# EasyEDA Pro project StimFilterV1.eprj, board PCB1
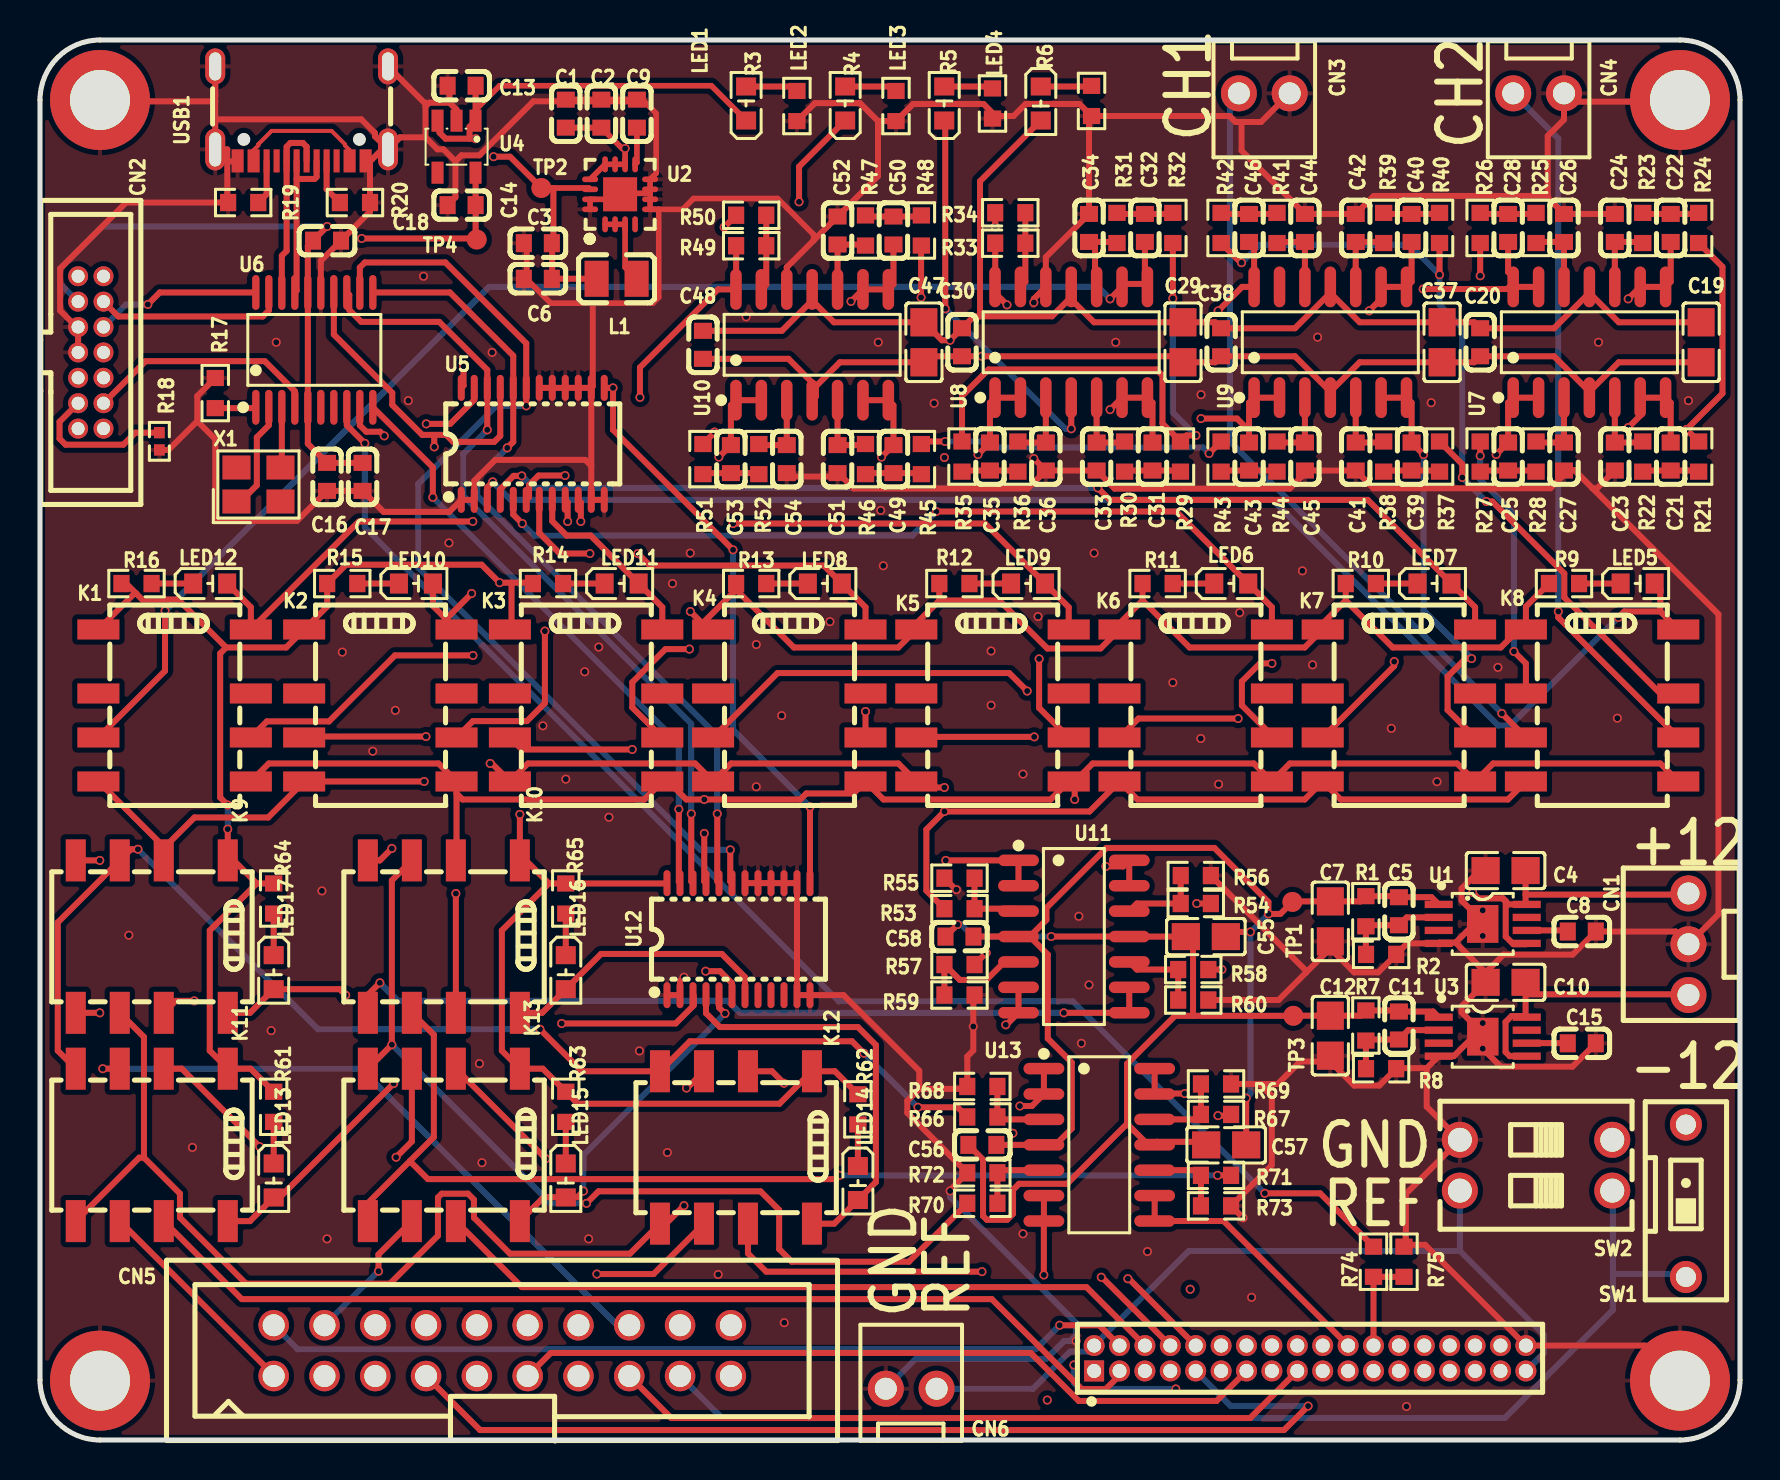
[diagram p2: board, top side]
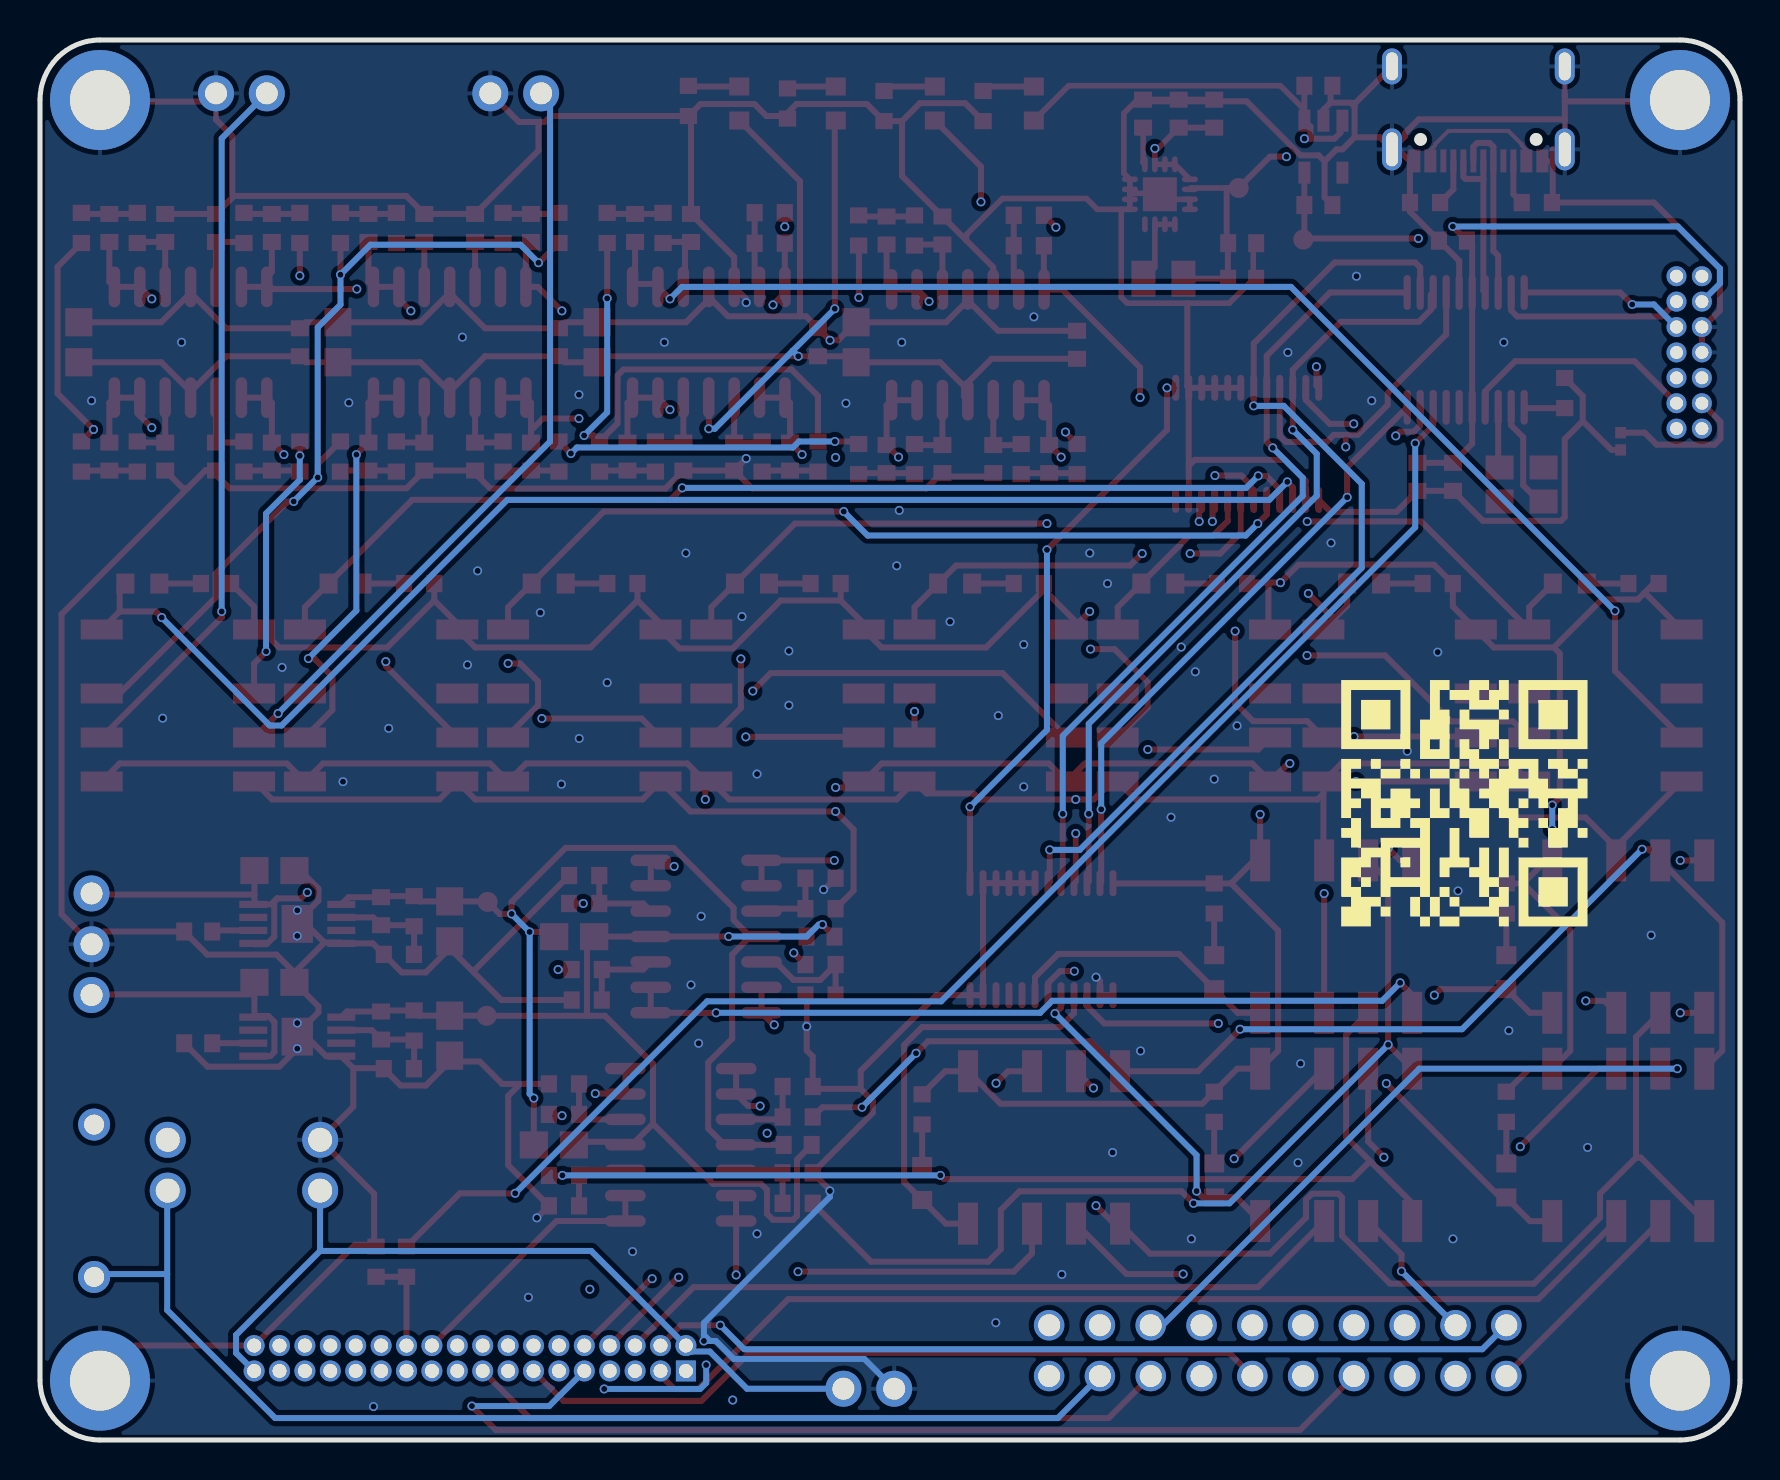
[diagram p3: board, bottom side, seen from below]

Outline 85 x 70 mm; copper layers: Top Layer, Inner1, Inner2, Bottom Layer. Coordinates in mm from the lower left corner of the outline.
Outline path: 0,67 0,3 arc(0.88,0.88) 3,0 82,0 arc(84.12,0.88) 85,3 85,67 arc(84.12,69.12) 82,70 3,70 arc(0.88,69.12) 0,67
Stack: Top Layer 0.035mm Outer layer thickness 1oz / Dielectric1 0.2104mm 7628 RC49% 8.6mil / Inner1 0.0152mm Inner layer thickness / Dielectric2 1.065mm 1.1mm H/HOZ Copper / Inner2 0.0152mm Inner layer thickness / Dielectric3 0.2104mm 7628 RC49% 8.6mil / Bottom Layer 0.035mm Outer layer thickness 1oz

## Design rules (mm)
template: Custom Config
spacing copperThickness1oz (default): track to track 0.102, other pairs 0.152 to 0.3
spacing copperThickness2oz: track to track 0.203, other pairs 0.152 to 0.3
spacing copperThicknessInner0.5oz: track to track 0.089, other pairs 0.152 to 0.3
track width copperThickness1oz (default): min 0.102, default 0.3, max 2.54
track width copperThickness2oz: min 0.203, default 0.254, max 2.54
track width copperThickness0.5oz: min 0.089, default 0.254, max 2.54
differential pair differentialPair (default): width min 0.127, default 0.254, max 2.54; gap min 0.152, default 0.152
via viaSize (default): diameter min 0.3, default 0.45, max 10; hole min 0.2, default 0.3, max 6.3

## Placement (name value [footprint] x y rotation side)
C1  10uF  [C0603]  26.29 66.32 90 top
C2  100nF  [C0603]  28.07 66.32 270 top
C3  22uF  [C0603]  24.89 59.84 0 top
C4  10uF  [C0805]  73.28 28.47 0 top
C5  10nF  [C0603]  67.94 26.44 90 top
C6  100nF  [C0603]  24.89 58.06 0 top
C7  10uF  [C0805]  64.52 25.93 90 top
C8  10nF  [C0603]  77.09 25.42 180 top
C9  3.3nF  [C0603]  29.84 66.32 270 top
C10  10uF  [C0805]  73.28 22.88 0 top
C11  10nF  [C0603]  67.94 20.72 90 top
C12  10uF  [C0805]  64.52 20.22 90 top
C13  10uF  [C0603]  21.08 67.71 180 top
C14  10uF  [C0603]  21.08 61.74 180 top
C15  10nF  [C0603]  77.09 19.83 180 top
C16  10uF  [C0603]  14.35 48.16 270 top
C17  100nF  [C0603]  16.13 48.16 90 top
C18  100nF  [C0603]  14.35 59.97 180 top
C19  10uF  [C0805]  83.06 54.89 270 top
C20  100nF  [C0603]  72.01 54.89 270 top
C21  15uF  [C0603]  81.53 49.17 90 top
C22  1.5uF  [C0603]  81.53 60.6 90 top
C23  10uF  [C0603]  78.74 49.17 90 top
C24  1uF  [C0603]  78.74 60.6 90 top
C25  15uF  [C0603]  73.41 49.17 90 top
C26  100nF  [C0603]  76.2 60.6 270 top
C27  10uF  [C0603]  76.2 49.17 90 top
C28  150nF  [C0603]  73.41 60.6 90 top
C29  10uF  [C0805]  57.15 54.89 270 top
C30  100nF  [C0603]  46.1 54.89 270 top
C31  150nF  [C0603]  55.63 49.17 90 top
C32  15nF  [C0603]  55.25 60.6 90 top
C33  100nF  [C0603]  52.83 49.17 90 top
C34  10nF  [C0603]  52.45 60.6 90 top
C35  15nF  [C0603]  47.5 49.17 90 top
C36  10nF  [C0603]  50.29 49.17 90 top
C37  10uF  [C0805]  70.1 54.89 270 top
C38  100nF  [C0603]  59.06 54.89 270 top
C39  15uF  [C0603]  68.58 49.17 90 top
C40  1.5uF  [C0603]  68.58 60.6 90 top
C41  10uF  [C0603]  65.79 49.17 90 top
C42  1uF  [C0603]  65.79 60.6 90 top
C43  15uF  [C0603]  60.45 49.17 90 top
C44  100nF  [C0603]  63.25 60.6 270 top
C45  10uF  [C0603]  63.25 49.17 90 top
C46  150nF  [C0603]  60.45 60.6 90 top
C47  10uF  [C0805]  44.2 54.89 270 top
C48  100nF  [C0603]  33.15 54.76 270 top
C49  150nF  [C0603]  42.67 49.05 90 top
C50  15nF  [C0603]  42.67 60.47 90 top
C51  100nF  [C0603]  39.88 49.05 90 top
C52  10nF  [C0603]  39.88 60.47 90 top
C53  15nF  [C0603]  34.54 49.05 90 top
C54  10nF  [C0603]  37.34 49.05 90 top
C55  10uF  [C0805]  58.29 25.17 0 top
C56  100nF  [C0603]  47.12 14.75 0 top
C57  10uF  [C0805]  59.31 14.75 0 top
C58  100nF  [C0603]  45.97 25.17 0 top
CN1  X2510WV-03-N0SN  [CONN-TH_3P-X2510WV-0X-N0SN]  82.42 24.79 270 top
CN2  HX JN1.27-2x7P ZZ H4.9  [IDC-TH_14P-P1.27_C42455940]  2.54 54.38 270 top
CN3  X2510WV-02-N0SN  [CONN-TH_2P-X2510WV-02-N0SN]  61.21 67.33 0 top
CN4  X2510WV-02-N0SN  [CONN-TH_2P-X2510WV-02-N0SN]  74.93 67.33 0 top
CN5  BH254V-20P  [CONN-TH_20P-P2.54_0702462001]  23.11 4.47 0 top
CN6  X2510WV-02-N0SN  [CONN-TH_2P-X2510WV-02-N0SN]  43.56 2.56 180 top
K1  G6K-2F-Y-TR DC5  [RELAY-SMD_G6K-2F-X-XX]  6.73 36.73 270 top
K2  G6K-2F-Y-TR DC5  [RELAY-SMD_G6K-2F-X-XX]  17.02 36.73 270 top
K3  G6K-2F-Y-TR DC5  [RELAY-SMD_G6K-2F-X-XX]  27.31 36.73 270 top
K4  G6K-2F-Y-TR DC5  [RELAY-SMD_G6K-2F-X-XX]  37.47 36.73 270 top
K5  G6K-2F-Y-TR DC5  [RELAY-SMD_G6K-2F-X-XX]  47.62 36.73 270 top
K6  G6K-2F-Y-TR DC5  [RELAY-SMD_G6K-2F-X-XX]  57.78 36.73 270 top
K7  G6K-2F-Y-TR DC5  [RELAY-SMD_G6K-2F-X-XX]  67.94 36.73 270 top
K8  G6K-2F-Y-TR DC5  [RELAY-SMD_G6K-2F-X-XX]  78.1 36.73 270 top
K9  G6K-2F-Y-TR DC5  [RELAY-SMD_G6K-2F-X-XX]  5.59 25.17 180 top
K10  G6K-2F-Y-TR DC5  [RELAY-SMD_G6K-2F-X-XX]  20.19 25.17 180 top
K11  G6K-2F-Y-TR DC5  [RELAY-SMD_G6K-2F-X-XX]  5.59 14.75 180 top
K12  G6K-2F-Y-TR DC5  [RELAY-SMD_G6K-2F-X-XX]  34.8 14.63 180 top
K13  G6K-2F-Y-TR DC5  [RELAY-SMD_G6K-2F-X-XX]  20.19 14.75 180 top
L1  2.2uH  [L0806]  28.83 58.06 180 top
LED1  A-SP192DGHC-C01-4T  [LED0603-FD]  35.31 66.82 270 top
LED2  A-SP192DGHC-C01-4T  [LED0603-FD]  40.26 66.82 270 top
LED3  A-SP192DGHC-C01-4T  [LED0603-FD]  45.21 66.82 270 top
LED4  A-SP192DGHC-C01-4T  [LED0603-FD]  50.04 66.82 90 top
LED5  A-SP192DGHC-C01-4T  [LED0603-FD]  79.88 42.82 180 top
LED6  A-SP192DGHC-C01-4T  [LED0603-FD]  59.56 42.82 180 top
LED7  A-SP192DGHC-C01-4T  [LED0603-FD]  69.72 42.82 180 top
LED8  A-SP192DGHC-C01-4T  [LED0603-FD]  39.24 42.82 180 top
LED9  A-SP192DGHC-C01-4T  [LED0603-FD]  49.4 42.82 180 top
LED10  A-SP192DGHC-C01-4T  [LED0603-FD]  18.8 42.82 180 top
LED11  A-SP192DGHC-C01-4T  [LED0603-FD]  29.08 42.82 180 top
LED12  A-SP192DGHC-C01-4T  [LED0603-FD]  8.51 42.82 180 top
LED13  A-SP192DGHC-C01-4T  [LED0603-FD]  11.68 12.98 90 top
LED14  A-SP192DGHC-C01-4T  [LED0603-FD]  40.89 12.85 90 top
LED15  A-SP192DGHC-C01-4T  [LED0603-FD]  26.29 12.98 90 top
LED16  A-SP192DGHC-C01-4T  [LED0603-FD]  26.29 23.39 90 top
LED17  A-SP192DGHC-C01-4T  [LED0603-FD]  11.68 23.39 90 top
NOREF  -  [Pad_e234]  3 67 90 top
NOREF#2  -  [Pad_e198]  3 2.97 180 top
NOREF#3  -  [Pad_e200]  82 2.97 270 top
NOREF#4  -  [Pad_e178]  82 67 0 top
R1  909kΩ  [R0603]  66.29 26.44 90 top
R2  137kΩ  [R0603]  67.06 24.28 180 top
R3  1kΩ  [R0603]  37.85 66.7 90 top
R4  324Ω  [R0603]  42.8 66.7 90 top
R5  2.61kΩ  [R0603]  47.62 66.82 90 top
R6  2.61kΩ  [R0603]  52.58 66.95 90 top
R7  909kΩ  [R0603]  66.29 20.72 90 top
R8  137kΩ  [R0603]  67.06 18.56 180 top
R9  1kΩ  [R0603]  76.2 42.82 180 top
R10  1kΩ  [R0603]  66.04 42.82 180 top
R11  1kΩ  [R0603]  55.88 42.82 180 top
R12  1kΩ  [R0603]  45.72 42.82 180 top
R13  1kΩ  [R0603]  35.56 42.82 180 top
R14  1kΩ  [R0603]  25.4 42.82 180 top
R15  1kΩ  [R0603]  15.11 42.82 180 top
R16  1kΩ  [R0603]  4.83 42.82 180 top
R17  10kΩ  [R0603]  8.76 52.35 90 top
R18  100Ω  [R0402]  5.97 49.93 90 top
R19  5.1kΩ  [R0603]  10.16 61.87 0 top
R20  5.1kΩ  [R0603]  15.75 61.87 180 top
R21  3.57kΩ  [R0603]  82.93 49.17 270 top
R22  7.32kΩ  [R0603]  80.14 49.17 90 top
R23  3.57kΩ  [R0603]  80.14 60.6 90 top
R24  1.82kΩ  [R0603]  82.93 60.6 270 top
R25  11.3kΩ  [R0603]  74.8 60.6 90 top
R26  5.49kΩ  [R0603]  72.01 60.6 270 top
R27  909Ω  [R0603]  72.01 49.17 270 top
R28  1.78kΩ  [R0603]  74.8 49.17 90 top
R29  1.37kΩ  [R0603]  57.02 49.17 270 top
R30  2.74kΩ  [R0603]  54.23 49.17 90 top
R31  7.15kΩ  [R0603]  53.85 60.6 90 top
R32  3.57kΩ  [R0603]  56.64 60.6 270 top
R33  10kΩ  [R0603]  48.51 59.84 0 top
R34  10kΩ  [R0603]  48.51 61.36 180 top
R35  6.98kΩ  [R0603]  46.1 49.17 270 top
R36  14kΩ  [R0603]  48.9 49.17 90 top
R37  3.57kΩ  [R0603]  69.98 49.17 270 top
R38  7.32kΩ  [R0603]  67.18 49.17 90 top
R39  3.57kΩ  [R0603]  67.18 60.6 90 top
R40  1.82kΩ  [R0603]  69.98 60.6 270 top
R41  11.3kΩ  [R0603]  61.85 60.6 90 top
R42  5.49kΩ  [R0603]  59.06 60.6 270 top
R43  909Ω  [R0603]  59.06 49.17 270 top
R44  1.78kΩ  [R0603]  61.85 49.17 90 top
R45  1.37kΩ  [R0603]  44.07 49.05 270 top
R46  2.74kΩ  [R0603]  41.28 49.05 90 top
R47  7.15kΩ  [R0603]  41.28 60.47 90 top
R48  3.57kΩ  [R0603]  44.07 60.47 270 top
R49  10kΩ  [R0603]  35.56 59.71 0 top
R50  10kΩ  [R0603]  35.56 61.24 180 top
R51  6.98kΩ  [R0603]  33.15 49.05 270 top
R52  14kΩ  [R0603]  35.94 49.05 90 top
R53  40kΩ  [R0603]  45.97 26.57 180 top
R54  40kΩ  [R0603]  57.79 26.82 0 top
R55  10kΩ  [R0603]  45.97 28.09 0 top
R56  10kΩ  [R0603]  57.79 28.22 180 top
R57  40kΩ  [R0603]  45.97 23.77 0 top
R58  40kΩ  [R0603]  57.66 23.52 0 top
R59  10kΩ  [R0603]  45.97 22.25 180 top
R60  10kΩ  [R0603]  57.66 22 180 top
R61  1kΩ  [R0603]  11.68 16.66 90 top
R62  1kΩ  [R0603]  40.89 16.53 90 top
R63  1kΩ  [R0603]  26.29 16.66 90 top
R64  1kΩ  [R0603]  11.68 27.07 90 top
R65  1kΩ  [R0603]  26.29 27.07 90 top
R66  100kΩ  [R0603]  47.12 16.15 180 top
R67  100kΩ  [R0603]  58.8 16.28 0 top
R68  1kΩ  [R0603]  47.12 17.68 0 top
R69  1kΩ  [R0603]  58.8 17.8 180 top
R70  100kΩ  [R0603]  47.12 11.83 180 top
R71  100kΩ  [R0603]  58.8 13.23 0 top
R72  1kΩ  [R0603]  47.12 13.36 0 top
R73  1kΩ  [R0603]  58.8 11.71 180 top
R74  1.65MΩ  [R0603]  66.68 8.91 90 top
R75  1kΩ  [R0603]  68.2 8.91 270 top
SW1  DSWB01LHGET  [SW-TH_DSWB01LHGETR]  82.3 11.96 0 top
SW2  DSWB02LHGET  [SW-TH_DSWB02LHGET]  74.8 13.74 90 top
TP1  -  [Test-Point-0.5mm]  62.62 26.9 0 top
TP2  -  [Test-Point-0.5mm]  25.07 62.6 0 top
TP3  -  [Test-Point-0.5mm]  62.67 21.21 0 top
TP4  -  [Test-Point-0.5mm]  21.84 60.02 0 top
U1  TPS7A4901DGNR  [HVSSOP-8_L3.0-W3.0-P0.65-LS4.9-BL-EP_DGN0008D]  72.14 25.8 270 top
U2  TPS62143RGTR  [TQFN-16_L3.0-W3.0-P0.50-TL-EP1.7]  29.01 62.28 90 top
U3  TPS7A3001DGNR  [HVSSOP-8_L3.0-W3.0-P0.65-LS4.9-BL-EP_DGN0008D]  72.14 20.17 270 top
U4  LP5907MFX-3.3/NOPB  [SOT-23-5_L3.0-W1.7-P0.95-LS2.8-BR]  20.83 64.67 90 top
U5  NCV7240BDPR2G  [SSOP-24_L8.7-W3.9-P0.65-LS6.0-BL]  24.64 49.81 0 top
U6  STM32F070F6P6  [TSSOP-20_L6.5-W4.4-P0.65-LS6.4-BL]  13.72 54.51 0 top
U7  OPA4187IDR  [SOIC-14_L8.7-W3.9-P1.27-LS6.0-BL]  77.47 54.89 0 top
U8  OPA4187IDR  [SOIC-14_L8.7-W3.9-P1.27-LS6.0-BL]  51.56 54.89 0 top
U9  OPA4187IDR  [SOIC-14_L8.7-W3.9-P1.27-LS6.0-BL]  64.52 54.89 0 top
U10  OPA4187IDR  [SOIC-14_L8.7-W3.9-P1.27-LS6.0-BL]  38.61 54.76 0 top
U11  OPA4187IDR  [SOIC-14_L8.7-W3.9-P1.27-LS6.0-BL]  51.69 25.17 270 top
U12  NCV7240BDPR2G  [SSOP-24_L8.7-W3.9-P0.65-LS6.0-BL]  34.93 25.04 0 top
U13  OPA4187IDR  [SOIC-14_L8.7-W3.9-P1.27-LS6.0-BL]  52.96 14.76 270 top
U14  PZ127-2-18-Z  [HDR-TH_36P-P1.27-V-M-R2-C18-S1.27]  63.5 4.09 0 top
USB1  TYPE-C16PIN  [USB-C-SMD_TYPE-C16PIN]  13.08 66.32 180 top
X1  8MHz  [CRYSTAL-SMD_4P-L3.2-W2.5-BL]  10.92 47.77 0 top

## Footprints (pads in the part's own frame, mm; a bottom-side part is the same pattern mirrored in y, then rotated)
C0603
  rect 0.8x0.9 smd: 1(-0.7,0) 2(0.7,0)
C0805
  rect 1.41x1.35 smd: 1(-1,0) 2(1,0)
CONN-TH_2P-X2510WV-02-N0SN
  round 1.8 hole 1.1: 1(-1.27,0) 2(1.27,0)
CONN-TH_3P-X2510WV-0X-N0SN
  round 1.8 hole 1.1: 1(-2.54,0) 2(0,0) 3(2.54,0)
CONN-TH_20P-P2.54_0702462001
  round 1.524 hole 1.1: 1(-11.43,-1.27) 2(-11.43,1.27) 3(-8.89,-1.27) 4(-8.89,1.27) 5(-6.35,-1.27) 6(-6.35,1.27) 7(-3.81,-1.27) 8(-3.81,1.27) 9(-1.27,-1.27) 10(-1.27,1.27) 11(1.27,-1.27) 12(1.27,1.27) 13(3.81,-1.27) 14(3.81,1.27) 15(6.35,-1.27) 16(6.35,1.27) 17(8.89,-1.27) 18(8.89,1.27) 19(11.43,-1.27) 20(11.43,1.27)
CRYSTAL-SMD_4P-L3.2-W2.5-BL
  rect 1.4x1.2 smd: 1(-1.1,-0.85) 2(1.1,-0.85) 3(1.1,0.85) 4(-1.1,0.85)
HDR-TH_36P-P1.27-V-M-R2-C18-S1.27
  rect 1x1.05 hole 0.7: 1(-10.795,-0.635)
  round 1.05 hole 0.7: 2(-10.795,0.635) 3(-9.525,-0.635) 4(-9.525,0.635) 5(-8.255,-0.635) 6(-8.255,0.635) 7(-6.985,-0.635) 8(-6.985,0.635) 9(-5.715,-0.635) 10(-5.715,0.635) 11(-4.445,-0.635) 12(-4.445,0.635) 13(-3.175,-0.635) 14(-3.175,0.635) 15(-1.905,-0.635) 16(-1.905,0.635) 17(-0.635,-0.635) 18(-0.635,0.635) 19(0.635,-0.635) 20(0.635,0.635) 21(1.905,-0.635) 22(1.905,0.635) 23(3.175,-0.635) 24(3.175,0.635) 25(4.445,-0.635) 26(4.445,0.635) 27(5.715,-0.635) 28(5.715,0.635) 29(6.985,-0.635) 30(6.985,0.635) 31(8.255,-0.635) 32(8.255,0.635) 33(9.525,-0.635) 34(9.525,0.635) 35(10.795,-0.635) 36(10.795,0.635)
HVSSOP-8_L3.0-W3.0-P0.65-LS4.9-BL-EP_DGN0008D
  rect 0.364x1.4 smd: 1(-0.975,-2.2) 2(-0.325,-2.2) 3(0.325,-2.2) 4(0.975,-2.2) 5(0.975,2.2) 6(0.325,2.2) 7(-0.325,2.2) 8(-0.975,2.2)
  rect 1.89x1.57 smd: 9(0,0)
IDC-TH_14P-P1.27_C42455940
  round 1 hole 0.65: 1(-3.81,-0.635) 2(-3.81,0.635) 3(-2.54,-0.635) 4(-2.54,0.635) 5(-1.27,-0.635) 6(-1.27,0.635) 7(0,-0.635) 8(0,0.635) 9(1.27,-0.635) 10(1.27,0.635) 11(2.54,-0.635) 12(2.54,0.635) 13(3.81,-0.635) 14(3.81,0.635)
L0806
  rect 1.2x1.8 smd: 1(-1,0) 2(1,0)
LED0603-FD
  rect 0.9x1 smd: 1(-0.85,0) 2(0.85,0)
Pad_e178
  round 5 hole 3: 1(0,0)
Pad_e198
  round 5 hole 3: 1(0,0)
Pad_e200
  round 5 hole 3: 1(0,0)
Pad_e234
  round 5 hole 3: 1(0,0)
R0402
  rect 0.566x0.54 smd: 1(-0.433,0) 2(0.433,0)
R0603
  rect 0.806x0.864 smd: 1(-0.753,0) 2(0.753,0)
RELAY-SMD_G6K-2F-X-XX
  rect 1x2.1 smd: 1(-3.8,-3.81) 2(-0.6,-3.81) 3(1.6,-3.81) 4(3.8,-3.81) 5(3.8,3.81) 6(1.6,3.81) 7(-0.6,3.81) 8(-3.8,3.81)
SOIC-14_L8.7-W3.9-P1.27-LS6.0-BL
  oval 0.574x2.038 smd: 1(-3.81,-2.769) 2(-2.54,-2.769) 3(-1.27,-2.769) 4(0,-2.769) 5(1.27,-2.769) 6(2.54,-2.769) 7(3.81,-2.769) 8(3.81,2.769) 9(2.54,2.769) 10(1.27,2.769) 11(0,2.769) 12(-1.27,2.769) 13(-2.54,2.769) 14(-3.81,2.769)
SOT-23-5_L3.0-W1.7-P0.95-LS2.8-BR
  rect 1.1x0.6 smd: 1(1.3,-0.95) 2(1.3,0) 3(1.3,0.95) 4(-1.3,0.95) 5(-1.3,-0.95)
SSOP-24_L8.7-W3.9-P0.65-LS6.0-BL
  oval 0.35x1.3 smd: 1(-3.575,-2.8) 2(-2.925,-2.8) 3(-2.275,-2.8) 4(-1.625,-2.8) 5(-0.975,-2.8) 6(-0.325,-2.8) 7(0.325,-2.8) 8(0.975,-2.8) 9(1.625,-2.8) 10(2.275,-2.8) 11(2.925,-2.8) 12(3.575,-2.8) 13(3.575,2.8) 14(2.925,2.8) 15(2.275,2.8) 16(1.625,2.8) 17(0.975,2.8) 18(0.325,2.8) 19(-0.325,2.8) 20(-0.975,2.8) 21(-1.625,2.8) 22(-2.275,2.8) 23(-2.925,2.8) 24(-3.575,2.8)
SW-TH_DSWB01LHGETR
  round 1.6 hole 1: 1(0,-3.81) 2(0,3.81)
SW-TH_DSWB02LHGET
  round 1.8 hole 1.2: 1(-1.27,3.81) 2(1.27,3.81) 3(-1.27,-3.81) 4(1.27,-3.81)
Test-Point-0.5mm
  round 1 smd: 1(0,0)
TQFN-16_L3.0-W3.0-P0.50-TL-EP1.7
  oval 0.8x0.28 smd: 1(-1.5,0.75) 2(-1.5,0.25) 3(-1.5,-0.25) 4(-1.5,-0.75) 9(1.5,-0.75) 10(1.5,-0.25) 11(1.5,0.25) 12(1.5,0.75)
  oval 0.28x0.8 smd: 5(-0.75,-1.5) 6(-0.25,-1.5) 7(0.25,-1.5) 8(0.75,-1.5) 13(0.75,1.5) 14(0.25,1.5) 15(-0.25,1.5) 16(-0.75,1.5)
  rect 1.7x1.7 smd: 17(0,0)
TSSOP-20_L6.5-W4.4-P0.65-LS6.4-BL
  oval 0.364x1.742 smd: 1(-2.925,-2.871) 2(-2.275,-2.871) 3(-1.625,-2.871) 4(-0.975,-2.871) 5(-0.325,-2.871) 6(0.325,-2.871) 7(0.975,-2.871) 8(1.625,-2.871) 9(2.275,-2.871) 10(2.925,-2.871) 11(2.925,2.871) 12(2.275,2.871) 13(1.625,2.871) 14(0.975,2.871) 15(0.325,2.871) 16(-0.325,2.871) 17(-0.975,2.871) 18(-1.625,2.871) 19(-2.275,2.871) 20(-2.925,2.871)
USB-C-SMD_TYPE-C16PIN
  oval 1x2.1 hole 0.6x1.7: 1(-4.32,1.788) 2(4.32,1.788)
  oval 1x1.8 hole 0.6x1.4: 3(-4.32,-2.362) 4(4.32,-2.362)
  rect 0.6x1.15 smd: A1B12(-3.2,2.362) A4B9(-2.4,2.362) B1A12(3.2,2.362) B4A9(2.4,2.362)
  rect 0.3x1.15 smd: A5(-1.25,2.362) A6(-0.25,2.362) A7(0.25,2.362) A8(-1.75,2.362) B5(1.75,2.362) B6(0.75,2.362) B7(-0.75,2.362) B8(1.25,2.362)

## Nets
As in the schematic, except:
GND: C1.2 C2.1 C3.1 C4.1 C6.1 C7.1 C8.1 C9.1 C10.1 C12.1 C13.2 C14.2 C15.1 C16.2 C17.1 C18.1 C23.1 C24.2 C26.1 C27.1 C33.1 C34.2 C36.1 C41.1 C42.2 C44.1 C45.1 C51.1 C52.2 C54.1 CN1.2 CN2.5 CN2.7 CN3.2 CN4.2 CN6.2 NOREF.1 NOREF#2.1 NOREF#3.1 NOREF#4.1 R2.1 R3.1 R4.1 R5.1 R6.1 R8.1 R17.2 R18.1 R19.1 R20.1 R55.1 R56.1 R59.1 R60.1 R68.1 R69.1 R72.1 R73.1 R75.1 SW2.2 U1.4 U1.9 U2.5 U2.6 U2.7 U2.8 U2.15 U2.16 U2.17 U3.4 U3.9 U4.2 U5.1 U5.2 U5.11 U5.12 U5.14 U5.15 U5.16 U5.17 U5.18 U6.15 U8.12 U10.12 U12.1 U12.2 U12.11 U12.12 U12.14 U12.15 U12.16 U12.17 U12.18 U14.1 U14.36 USB1.1 USB1.2 USB1.3 USB1.4 USB1.A1B12 USB1.B1A12

Pads without a net: CN2 1 2 9 10 13 14; K1 2 7; K2 2 7; K3 2 7; K4 2 7; K5 2 7; K6 2 7; K7 2 7; U1 3 7; U2 4; U3 3 7; U4 4; U6 6 7; U9 13; U12 8 9 10; U14 23 25 26 27 28 29 30 31 32 33 34; USB1 A8 B8; X1 2 4

## Via types
v1: diameter 0.45, hole 0.3, Top Layer to Bottom Layer, 235 vias

## Routing (per net, layer and track width the routed paths; a pad name or vN(x,y) marks a point on that pad's centre or on a via; arc(x,y) is an arc through that point)
3V3: length 104.8
  Top Layer w0.3: 21.78,60.08 21.78,63.36 ; 21.78,60.08 TP4.1 ; 21.78,60.08 v1(16.08,60.08) ; U5.13 v1(28.65,52.61) 28.65,50.51 v1(34.65,44.51) ; v1(14.36,60.68) C18.2 13.39,59.71 U6.16 U6.5 13.39,49.82 C16.1 C17.2 ; LED2.2 37.95,63.67 v1(37.95,61.91) ; v1(38.5,31.66) U12.13
  Inner2 w0.3: v1(14.36,60.68) 14.58,60.68 15.18,60.08 v1(16.08,60.08) 20.58,60.08 28.05,52.61 v1(28.65,52.61) v1(37.95,61.91)
  Bottom Layer w0.3: CN2.3 1,57.82 1,58.58 3.11,60.68 v1(14.36,60.68) ; v1(38.5,31.66) 34.65,35.51 v1(34.65,44.51)
5V: length 231.5
  Top Layer w0.28: TP2.1 27.44,62.6 U2.14 ; 21.78,66.51 22.98,67.71 33.57,67.71 LED1.2
  Top Layer w0.3: 21.48,65.07 21.48,65.67 U4.1 ; 21.48,65.07 20.28,65.07 19.98,65.37 19.98,65.87 U4.3 ; 21.48,65.07 v1(21.78,65.07) ; K1.1 4.72,42.33 4.81,42.33 ; 55.13,41.98 57.48,39.63 63.24,39.63 K7.1 64.13,40.83 65.29,41.98 ; 55.13,41.98 R11.2 ; 55.13,41.98 53.97,40.83 K6.1 53.03,39.58 50.37,39.58 47.97,41.98 44.97,41.98 ; 34.81,42.51 R13.2 ; 34.81,42.51 37.69,39.63 42.91,39.63 K5.1 43.81,40.83 44.97,41.98 ; 34.81,42.51 33.12,40.83 ; v1(21.18,53.67) 21.18,52.72 U5.24 ; 25.44,27.83 24.29,28.98 K10.1 v1(23.99,31.28) ; 25.44,27.83 R65.2 31.34,27.83 U12.24 ; 25.44,27.83 23.09,25.48 23.09,19.46 K13.1 25.14,18.56 R63.2 26.89,16.81 36.97,16.81 K12.1 39.74,18.44 R62.2 ; R14.2 24.6,42.87 23.58,42.87 ; v1(32.52,41.43) 33.12,40.83 ; 33.12,40.83 33.42,40.53 K4.1 ; R61.2 10.53,18.56 K11.1 8.49,19.46 8.49,25.48 10.84,27.83 ; 44.97,41.98 R12.2 ; 65.29,41.98 67.64,39.63 73.04,39.63 73.94,40.53 K8.1 74.29,41.67 R9.2 ; 65.29,41.98 R10.2 ; R16.2 4.31,42.82 4.81,42.33 ; v1(9.39,30.55) K9.1 9.69,28.98 10.84,27.83 ; 21.78,65.97 21.78,67.71 ; 25.61,59.84 25.61,58.08 C6.2 L1.2 ; 25.61,59.84 C3.2 ; 25.61,59.84 25.67,59.9 25.67,62.6 ; 23.58,42.87 v1(22.98,42.87) 22.08,43.77 15.3,43.77 R15.2 14.36,41.68 K2.1 12.31,39.63 9.31,39.63 ; 23.58,42.87 23.58,40.61 K3.1 ; v1(9.39,31.75) 9.01,32.13 9.01,39.33 9.31,39.63 ; v1(22.68,64.17) 23.5,64.17 TP2.1 ; 9.31,39.63 6.91,42.03 5.11,42.03 4.81,42.33 ; 10.84,27.83 R64.2
  Inner1 w0.3: v1(22.68,64.17) 22.68,56.67 21.18,55.17 v1(21.18,53.67) ; v1(22.98,42.87) 24.78,41.07 ; 24.78,41.07 23.99,40.28 v1(23.99,31.28) ; 24.78,41.07 32.16,41.07 v1(32.52,41.43)
  Inner2 w0.3: v1(22.98,42.87) 22.98,43.77 20.88,45.87 20.88,53.37 v1(21.18,53.67) ; v1(21.78,65.07) v1(22.68,64.17)
  Bottom Layer w0.3: v1(9.39,31.75) v1(9.39,30.55)
+9V: length 159.7
  Top Layer w0.3: C55.2 59.53,25.4 v1(60.52,25.4) ; 38.8,52.69 40,53.89 C47.2 44.5,54.19 C30.2 v1(47.09,54.19) 56.85,54.19 C29.2 58.75,53.89 C38.2 62.75,54.19 64.52,52.42 ; 38.8,52.69 38.8,52.18 38.61,51.99 ; 38.8,52.69 37.42,54.06 C48.2 ; v1(60.31,17.09) C57.2 ; C19.2 78.94,53.89 77.47,52.42 ; 77.47,52.42 U7.4 ; 77.47,52.42 75.7,54.19 C20.2 71.71,53.89 C37.2 65.99,53.89 64.52,52.42 ; 49.49,25.17 50.39,24.27 50.39,20.07 51.59,18.87 51.59,15.57 50.77,14.75 C56.2 ; 49.49,25.17 U11.4 46.68,25.17 ; 49.49,25.17 50.32,26 50.32,26.6 53.32,29.6 58.72,29.6 61.42,26.9 v1(61.42,26.3) 62.02,26.3 TP1.1 62.65,26.93 C7.2 66.03,26.93 R1.2 67.89,27.19 C5.2 69.58,27.14 U1.1 ; 64.52,52.42 U9.4 ; LED3.2 45.26,65.92 v1(45.26,56.56) ; v1(51.56,50.56) U8.4
  Inner1 w0.3: v1(61.42,26.3) 51.56,36.16 v1(51.56,50.56)
  Bottom Layer w0.3: v1(51.56,50.56) 51.26,50.56 47.36,54.46 ; 47.36,54.46 v1(45.26,56.56) ; 47.36,54.46 v1(47.09,54.19) ; v1(61.42,26.3) v1(60.52,25.4) 60.52,17.3 v1(60.31,17.09)
+12V: length 86
  Top Layer w0.28: v1(71.64,27.38) 71.94,27.08 ; U2.13 U2.12 U2.11 U2.10 v1(29.26,64.58) 29.1,64.58 C2.2
  Top Layer w0.3: 73.29,26.93 73.29,26.94 73.15,27.08 73.14,27.08 ; 73.29,26.93 73.44,26.78 U1.8 74.28,26.84 74.28,27.27 ; 73.29,26.93 73.29,25.17 73.67,24.79 74.29,24.79 74.34,24.83 ; 73.29,26.93 73.14,27.08 ; 73.14,27.08 71.94,27.08 ; 74.28,27.27 C4.2 ; 74.28,27.27 82.37,27.27 CN1.1 ; C2.2 C1.1
  Inner1 w0.28: v1(29.26,64.58) 44.64,64.58 52.14,57.08 52.14,46.88 v1(71.64,27.38)
-9V: length 153.1
  Top Layer w0.3: 38.61,56.97 U10.11 ; 38.61,56.97 37.09,55.46 C48.1 ; 38.61,56.97 39.7,55.89 C47.1 45.1,54.99 v1(45.5,54.99) C30.1 46.7,56.19 47,56.19 ; U8.11 51.5,57.59 51.5,57.09 ; U3.1 69.66,21.42 C11.2 67.89,21.48 R7.2 66.03,21.22 C12.2 62.67,21.22 ; 55.85,14.91 55.25,14.91 54.35,15.81 ; 55.85,14.91 U13.11 ; 55.85,14.91 58.15,14.91 C57.1 ; 57.65,21.21 56.75,21.21 54.35,18.81 54.35,15.81 ; 57.65,21.21 57.65,24.81 C55.1 54.47,25.17 ; 57.65,21.21 TP3.1 ; 77.47,57.36 78.94,55.89 C19.1 ; 77.47,57.36 U7.11 ; 77.47,57.36 75.7,55.59 C20.1 71.71,55.89 C37.1 65.99,55.89 64.52,57.36 ; 51.5,57.09 52.7,55.89 C29.1 58.75,55.89 C38.1 62.75,55.59 64.52,57.36 ; 51.5,57.09 50.6,56.19 47,56.19 ; U11.11 v1(50.56,25.17) ; 64.52,57.36 U9.11 ; v1(45.88,25.77) C58.1 ; 54.35,15.81 51.35,12.81 48.95,12.81 48.65,12.51 48.65,11.31 48.35,11.01 47.34,11.01 47.15,11.2 47.15,14.02 C56.1 ; LED4.1 47,62.94 47,56.19
  Inner1 w0.3: v1(45.5,54.99) 45.5,54.8 46.1,54.2 46.1,28.1 46.4,27.8 46.4,26.3 v1(45.88,25.77)
  Bottom Layer w0.3: v1(50.56,25.17) 46.66,25.17 46.06,25.77 v1(45.88,25.77)
-12V: length 13.7
  Top Layer w0.3: 74.28,21.2 U3.8 ; 74.28,21.2 73.58,21.2 73.28,20.9 73.28,19.4 73.49,19.19 U3.5 ; 74.28,21.2 74.28,22.28 ; CN1.3 82.39,22.28 74.28,22.28 ; C10.2 74.28,22.28
GND: length 543.2
  Top Layer w0.28: 29.93,66.94 30.21,66.94 30.81,66.33 30.81,63.33 U2.8 U2.7 30.51,62.33 ; C3.1 24.34,59.69 24.34,58.04 25.54,56.84 30.64,56.84 30.94,57.14 30.94,61.53 ; 30.94,61.53 U2.5 U2.6 30.51,62.33 ; 30.94,61.53 32.14,61.53 32.68,62.07 36.88,62.07 38.68,60.27 38.68,59.97 ; 30.51,62.33 29.06,62.33 U2.17 28.76,62.03 U2.15 U2.16
  Top Layer w0.3: 63.31,23.38 63.31,23.45 R56.1 ; 63.31,23.38 64.51,24.58 ; 63.31,23.38 61.93,22 R60.1 ; 19.27,65.13 19.87,64.53 20.17,64.53 20.77,63.94 ; 19.27,65.13 18.01,65.13 USB1.1 ; 19.27,65.13 19.27,66.67 19.46,66.87 20.47,66.87 ; 75.39,62.2 75.39,62.12 C26.1 C24.2 ; 75.39,62.2 66.69,62.2 C42.2 C44.1 60.08,64.47 60.08,65.9 ; 75.39,62.2 75.39,65.2 76.2,66.02 76.2,66.92 ; U4.2 20.83,66.51 20.47,66.87 ; 76.2,66.92 81.92,66.92 NOREF#4.1 ; 76.2,66.92 76.2,67.33 ; U5.14 27.64,52.68 27.64,56.84 ; U5.14 27.56,48.71 ; U5.14 U5.15 U5.16 U5.17 U5.18 ; 60.08,65.9 59.78,65.9 59.48,66.2 R6.1 ; 60.08,65.9 61.05,65.9 CN3.2 ; NOREF.1 3.07,66.93 8.76,66.93 ; 41.9,65.94 R4.1 43.65,66.8 47.18,66.8 47.78,66.2 ; 41.9,65.94 41,66.84 38.75,66.84 R3.1 ; 41.9,65.94 41.9,63.2 C52.2 37.34,58.63 U10.12 ; 1.91,55.57 1.01,56.47 1.01,58.57 4.31,61.87 R19.1 9.36,61.91 9.36,63.93 ; 1.91,55.57 CN2.7 ; 1.91,55.57 CN2.5 ; 69.34,18.59 U3.4 70.69,19.19 71.68,20.18 71.68,20.78 ; 69.34,18.59 67.84,18.59 R8.1 66.97,17.72 65.71,17.72 64.51,18.92 ; 69.34,18.59 69.34,16.66 SW2.2 68.29,12.31 68.29,9.76 ; 16.5,63.93 USB1.A1B12 ; 16.5,63.93 R20.1 16.5,61.42 C18.1 14.04,58.96 U6.15 ; 16.5,63.93 17.1,64.53 USB1.1 ; 72.28,23.37 C10.1 71.08,21.68 71.08,21.38 71.68,20.78 ; 72.28,23.37 73.18,24.27 76.64,24.27 C8.1 81.79,25.42 CN1.2 83.92,26.29 83.92,41.29 77.62,47.59 ; 72.28,23.37 70.78,24.87 ; C13.2 20.47,67.62 20.47,66.87 ; 71.68,26.37 71.68,25.77 70.78,24.87 ; 71.68,26.37 72.14,25.91 U1.9 ; 71.68,26.37 71.08,26.97 71.08,27.57 71.98,28.47 C4.1 ; 39.79,48.17 39.79,48.26 C51.1 ; 39.79,48.17 37.51,48.17 C54.1 ; 39.79,48.17 40.09,48.17 40.69,47.57 49.39,47.57 C36.1 ; 9.36,63.93 9.86,63.93 USB1.B1A12 ; 9.36,63.93 9.36,64.53 USB1.2 8.76,66.03 ; 8.76,66.03 8.76,66.93 ; 8.76,66.03 16.06,66.03 16.75,65.35 16.75,65.18 USB1.1 ; C23.1 77.86,47.59 77.62,47.59 ; 64.51,24.58 65.71,23.38 66.91,23.38 R2.1 68.36,24.83 69.94,24.83 69.98,24.87 70.78,24.87 ; 64.51,24.58 C7.1 ; 7.86,50.94 6.42,49.5 R18.1 ; 7.86,50.94 7.86,52.2 R17.2 ; 7.86,50.94 8.76,50.04 8.76,46.14 8.95,45.96 12.85,45.96 C16.2 C17.1 17.18,46.41 20.46,46.41 U5.1 U5.2 21.71,47.96 22.76,49.01 27.26,49.01 27.56,48.71 ; 27.56,48.71 U5.11 U5.12 ; 71.68,20.78 72.14,20.32 U3.9 v1(72.14,19.57) 73.04,18.67 76.62,18.67 C15.1 ; C1.2 C2.1 C9.1 ; 76.42,48.49 C27.1 ; 76.42,48.49 76.72,48.49 77.62,47.59 ; 76.42,48.49 75.52,47.59 66.67,47.59 C41.1 63.39,48.47 ; 47.78,66.2 48.68,66.2 49.28,66.8 51.98,66.8 R6.1 ; 47.78,66.2 R5.1 ; v1(45.5,12.45) 45.5,12.5 R72.1 43.36,16.36 43.36,16.96 43.96,17.56 ; 68.29,9.76 R75.1 ; 68.29,9.76 69.26,9.76 U14.36 80.25,4.72 NOREF#3.1 ; C36.1 v1(49.69,49.07) ; C36.1 C33.1 53.73,47.57 62.49,47.57 63.39,48.47 ; R6.1 52.45,66.07 C34.2 50.29,59.14 U8.12 49.69,57.06 v1(49.69,56.87) ; 60.99,17.8 R69.1 ; 60.99,17.8 61.89,17.8 63.01,18.92 64.51,18.92 ; 60.99,17.8 61.59,17.2 61.59,13.74 R73.1 v1(60.15,11.11) ; 8.76,66.93 8.76,67.23 8.76,67.23 8.76,68.68 ; 24.34,58.04 24.21,58.04 C6.1 ; 20.77,63.94 21.07,64.23 21.97,64.23 24.67,66.94 29.93,66.94 ; 20.77,63.94 20.77,62.13 C14.2 ; 43.96,17.56 43.96,18.46 40.18,22.24 U12.12 U12.11 U12.14 U12.16 U12.17 U12.18 ; 43.96,17.56 46.25,17.56 R68.1 46.36,19.18 46.66,19.48 v1(46.66,20.68) 46.66,22.18 R59.1 ; R55.1 45.79,27.52 v1(45.82,27.52) ; 64.51,18.92 C12.1 ; U12.1 U12.2 32,22.94 v1(32.2,23.14) ; 63.39,48.47 C45.1 ; USB1.3 19.21,66.87 19.27,66.87
  Inner1 w0.3: 45.22,22.12 45.22,26.92 v1(45.82,27.52) ; 45.22,22.12 33.22,22.12 v1(32.2,23.14) 24.4,23.14 4.3,3.04 3.08,3.04 NOREF#2.1 ; 45.22,22.12 v1(46.66,20.68) ; v1(51.81,4.95) 50.91,4.05 50.91,3.75 51.5,3.15 52.41,3.15 U14.1
  Inner2 w0.3: v1(49.69,49.07) v1(49.69,56.87) ; v1(51.81,4.95) 51.82,4.96 51.82,5.17 52.95,6.31 55.35,6.31 v1(60.15,11.11)
  Bottom Layer w0.3: CN6.2 43.78,4.05 50.31,4.05 51.21,4.95 51.5,4.95 ; v1(51.81,4.95) 51.5,4.95 ; 51.5,4.95 51.81,5.25 51.81,5.85 45.5,12.15 v1(45.5,12.45)
  vias: v1(4.44,25.24) v1(7.62,14.63) v1(11.56,20.47) v1(11.81,54.89) v1(14.1,27.45) v1(14.35,10.06) v1(15.11,39.39) v1(16.64,34.44) v1(17.77,36.48) v1(18.41,51.97) v1(19.18,58.19) v1(20.45,44.85) v1(21.97,18.82) v1(22.1,13.87) v1(22.61,54.38) v1(25.15,35.71) v1(26.29,33.04) v1(27.24,38.41) v1(27.43,10.06) v1(27.94,39.65) v1(28.45,31.14) v1(29.97,19.45) v1(31.37,14.37) v1(31.62,42.82) v1(32.51,44.35) v1(33.91,8.28) v1(35.31,56.16) v1(35.81,39.77) v1(35.81,32.66) v1(37.08,36.22) v1(37.21,5.87) v1(39.5,40.92) v1(41.91,54.89) v1(42.04,46.48) v1(42.16,43.71) v1(44.7,51.84) v1(47.56,39.45) v1(47.56,36.74) v1(49.15,33.3) v1(49.15,10.31) v1(49.9,41.17) v1(51.94,26.19) v1(52.07,19.83) v1(52.45,22.76) v1(52.71,44.35) v1(53.78,54.89) v1(55.37,9.42) v1(56.64,37.87) v1(58.05,52.27) v1(58.04,35.07) v1(58.93,32.79) v1(59.98,41.37) v1(60.58,7.13) v1(63.12,43.46) v1(63.63,38.76) v1(63.88,55.14) v1(67.56,35.58) v1(68.33,1.67) v1(69.56,51.86) v1(69.85,32.92) v1(72.14,26.48) v1(72.14,25.2) v1(72.14,20.85) v1(72.9,38.63) v1(77.92,54.89) v1(78.87,36.09) v1(82.42,51.97)
VBUS: length 6.7
  Top Layer w0.2: USB1.A4B9 15.48,64.49 15.25,64.73 15.25,64.79 14.58,65.45 11.58,65.45 10.92,64.79 10.92,64.73 10.68,64.49 USB1.B4A9
A1: length 61.5
  Top Layer w0.3: R66.2 45.88,16.64 v1(43.9,16.64) ; v1(41.2,19.34) 40.6,19.94 32.5,19.94 K12.4 27.1,18.44 v1(25,20.54) ; v1(4.9,29.54) 4.55,29.54 0.89,25.88 0.89,19.46 1.79,18.56
  Bottom Layer w0.3: v1(41.2,19.34) v1(43.9,16.64) ; v1(4.9,29.54) 13.9,20.54 v1(25,20.54)
A1_D: length 48.4
  Top Layer w0.3: 1.79,28.98 v1(2.99,28.98) ; U11.1 U11.2 ; v1(45.29,28.98) 48.92,28.98
  Inner2 w0.3: v1(2.99,28.98) v1(45.29,28.98)
A2: length 47.4
  Top Layer w0.3: K13.4 v1(17.59,19.77) 17.59,27.98 K10.3 ; R70.2 43.44,8.91 37.59,8.91 36.96,9.55 36.96,11.5 36.02,12.43 27.92,12.43 v1(27.32,11.83)
  Bottom Layer w0.3: v1(17.59,19.77) 25.52,11.83 v1(27.32,11.83)
A2_D: length 40.6
  Top Layer w0.3: K10.4 16.99,28.98 v1(17.59,29.58) ; v1(53.29,28.68) 54.16,28.68 U11.14 U11.13
  Inner2 w0.3: v1(53.29,28.68) 51.79,30.18 34.39,30.18 33.79,29.58 v1(17.59,29.58)
AMP_CH1: length 51.8
  Top Layer w0.3: K11.7 10.09,7.04 47.59,7.04 52.09,2.54 53.29,2.54 53.97,3.23 U14.3
AMP_CH4: length 37
  Top Layer w0.3: U14.6 52.32,7.64 24.09,7.64 K13.7
AMP_CH8: length 42.7
  Top Layer w0.3: K13.2 v1(25.29,14.06) ; v1(54.39,8.06) 54.44,8.06 U14.10
  Inner1 w0.3: v1(25.29,14.06) 27.99,14.06 32.49,9.56 52.89,9.56 v1(54.39,8.06)
AMP_CH9: length 29.5
  Top Layer w0.3: v1(47.1,8.42) 36.31,8.42 35.4,9.33 K12.7
  Inner2 w0.3: v1(47.1,8.42) 47.1,7.52 52.8,1.82 57.42,1.82 U14.11
AMP_CH13: length 44.4
  Top Layer w0.3: K12.2 36.6,18.44 v1(37.2,17.84)
  Inner2 w0.3: U14.15 59.5,1.35 52.59,1.35 46.5,7.45 46.5,8.65 49.8,11.95 49.8,16.94 48.9,17.84 v1(37.2,17.84)
AMP_CH16: length 68.3
  Top Layer w0.3: K11.2 7.09,18.56 v1(10.99,14.66)
  Inner2 w0.3: v1(10.99,14.66) 28.39,14.66 32.29,18.56 52.09,18.56 58.99,11.66 60.49,11.66 62.89,9.27 62.89,4.75 U14.18
AMP_CH17: length 35.6
  Top Layer w0.3: v1(48.99,16.7) 49.59,16.7 U13.2 U13.1
  Inner2 w0.3: U14.19 61.44,0.75 52.44,0.75 45.99,7.19 45.99,8.99 49.29,12.29 49.29,16.4 v1(48.99,16.7)
AMP_CH18: length 18.2
  Top Layer w0.3: v1(57.24,17.32) 55.75,17.32 U13.13 U13.14
  Inner2 w0.3: U14.20 64.13,10.23 57.24,17.13 v1(57.24,17.32)
AMP_CH19: length 24.2
  Top Layer w0.3: U13.7 U13.6 ; v1(50.19,8.25) 50.19,10.95
  Inner1 w0.3: v1(56.79,2.55) 64.5,2.55 U14.21
  Inner2 w0.3: v1(50.19,8.25) 50.19,5.25 v1(51.69,3.75)
  Bottom Layer w0.3: v1(51.69,3.75) 51.69,2.85 51.99,2.55 v1(56.79,2.55)
AMP_CH20: length 13.5
  Top Layer w0.3: U13.9 U13.8 59.18,10.95 U14.22
AMP_CH22: length 5
  Top Layer w0.3: R75.2 R74.1 U14.24
C1: length 77.8
  Top Layer w0.3: 1.79,10.94 4.96,14.12 5.2,14.12 ; v1(32.2,11.72) 31.3,10.82 K12.5 29.5,9.32 23.5,9.32 21.7,11.12 21.7,12.02 21.4,12.32 20.09,12.32 19.9,12.13 19.9,10.22 17.5,7.82 10.3,7.82 7,11.12 7,12.32 5.2,14.12 ; 5.2,14.12 5.2,20.15 3.99,21.36 ; v1(58.9,16.22) 59.49,16.22 R67.2
  Inner1 w0.3: v1(32.2,11.72) 36.4,15.92 58.6,15.92 v1(58.9,16.22)
C1_D: length 49.4
  Top Layer w0.3: 1.79,21.36 v1(2.99,21.36) ; U11.6 U11.7 48.32,20.76 v1(48.29,20.76)
  Inner2 w0.3: v1(2.99,21.36) 33.29,21.36 33.89,20.76 44.99,20.76 45.59,21.36 47.69,21.36 v1(48.29,20.76)
C2: length 53.7
  Top Layer w0.3: K10.6 19.69,20.26 19.69,15.14 18.49,13.94 ; K13.5 16.39,11.84 18.49,13.94 ; 18.49,13.94 19.39,13.05 39.79,13.05 v1(39.98,13.23) ; v1(58.88,13.23) R71.2
  Bottom Layer w0.3: v1(39.98,13.23) v1(58.88,13.23)
C2_D: length 41.1
  Top Layer w0.3: v1(51.19,21.36) 54.46,21.36 ; K10.5 16.39,22.26 v1(16.99,22.86) ; U11.8 U11.9
  Bottom Layer w0.3: v1(16.99,22.86) 17.89,21.96 34.39,21.96 34.99,21.36 v1(51.19,21.36)
CH1_2HZ_A: length 27.2
  Top Layer w0.3: v1(79.41,50.62) 80.01,51.22 U7.6 U7.7 81.53,51.86 C21.2 ; K7.3 67.71,38.7 v1(67.71,38.92)
  Inner2 w0.3: v1(79.41,50.62) v1(67.71,38.92)
CH1_8HZ_A: length 29.3
  Top Layer w0.3: U7.2 U7.1 73.41,51.86 C25.2 v1(72.81,49.27) ; v1(59.91,36.07) 54.92,36.07 K6.3
  Inner2 w0.3: v1(72.81,49.27) 72.81,48.97 v1(59.91,36.07)
CH1_40HZ_A: length 49.1
  Top Layer w0.3: v1(79.41,57.06) U7.9 U7.8 81.53,57.91 C22.1 ; K5.3 43.84,35.16 v1(49.71,35.16)
  Inner2 w0.3: v1(79.41,57.06) 71.61,57.06 v1(49.71,35.16)
CH1_130HZ_A: length 54
  Top Layer w0.3: K4.3 36.88,38.35 48.46,38.35 v1(49.36,37.45) ; U7.13 U7.14 73.66,57.85 ; C28.1 73.41,58.4 73.66,58.15 73.66,57.85 ; 73.66,57.85 73.36,57.55 v1(69.16,57.55)
  Inner2 w0.3: v1(69.16,57.55) 69.16,57.25 v1(49.36,37.45)
CH1_530HZ_A: length 41.8
  Top Layer w0.3: C31.2 55.63,51.86 U8.7 U8.6 v1(53.5,51.52) ; v1(29.61,34.53) 24.09,34.53 K3.3
  Inner2 w0.3: v1(29.61,34.53) 36.51,34.53 v1(53.5,51.52)
CH1_1030HZ_A: length 44
  Top Layer w0.3: v1(46.9,49.27) C35.2 47.5,51.86 U8.1 U8.2 ; v1(19.3,35.17) 13.25,35.17 K2.3
  Inner2 w0.3: v1(46.9,49.27) 32.8,35.17 v1(19.3,35.17)
CH1_2030HZ_A: length 66.3
  Top Layer w0.3: C32.1 55.25,57.8 ; 55.25,57.8 54.25,57.8 U8.9 v1(53.5,57.06) ; 55.25,57.8 U8.8 ; v1(6.25,41.46) 6.25,38.46 K1.3
  Bottom Layer w0.3: v1(6.25,41.46) 22.45,57.66 52.9,57.66 v1(53.5,57.06)
CH1_A: length 88.2
  Top Layer w0.3: v1(73.69,39.43) 74.29,38.83 K8.2 ; v1(56.64,57.08) R32.2 ; v1(57.8,50.23) 57.32,50.23 R29.1 56.12,50.83 56.12,53.23 55.82,53.53 47.42,53.53 46.1,52.2 R35.1 ; v1(82.32,50.53) 84.12,52.33 84.12,58.66 R24.2 ; v1(72.01,49.21) R27.1 ; v1(72.01,58.21) R26.2 ; 82.33,50.53 R21.1
  Inner1 w0.3: 72.01,49.81 81.61,49.81 v1(82.32,50.53) ; 72.01,49.81 v1(72.01,58.21) ; 72.01,49.81 v1(72.01,49.21) ; 72.01,49.81 71.9,49.93 58.1,49.93 v1(57.8,50.23)
  Bottom Layer w0.3: v1(73.69,39.43) 73.69,46.33 72.01,48.01 v1(72.01,49.21) ; v1(56.64,57.08) 56.64,51.38 v1(57.8,50.23)
CH1_FILTER_A: length 116.1
  Top Layer w0.3: 6.22,29.63 6.22,29.01 K9.2 ; 6.22,29.63 K1.4 ; 6.22,29.63 7.72,31.13 11.41,31.13 K2.4 v1(19.21,32.93) ; v1(47.76,60.67) R34.2 ; v1(22.51,33.83) 22.59,33.83 K3.4 24.4,33.83 32.75,33.83 K4.4 34.56,33.83 42.91,33.83 K5.4 44.12,32.63 v1(45.22,32.63) ; K8.4 73.4,32.03 65.03,32.03 K7.4 63.24,32.03 54.88,32.03 K6.4 52.47,31.43 v1(45.22,31.43) 44.32,30.53 44.32,27.47 R53.2
  Inner1 w0.3: v1(45.22,49.13) 45.52,48.83 45.52,32.93 v1(45.22,32.63) v1(45.22,31.43)
  Inner2 w0.3: v1(45.22,49.13) 47.76,51.67 v1(47.76,60.67) ; v1(22.51,33.83) 21.61,32.93 v1(19.21,32.93)
CH1_FILTER_C: length 79.4
  Top Layer w0.3: R33.1 47.76,57.66 U8.14 47.75,57.36 v1(48.35,56.76) ; v1(7.71,21.96) 6.78,21.96 K9.7 ; v1(47.31,24.36) R57.2
  Inner1 w0.3: v1(47.31,24.36) 47.45,24.36 48.35,25.26 v1(48.35,56.76)
  Inner2 w0.3: v1(47.31,24.36) 10.11,24.36 v1(7.71,21.96)
CH1_INPUT: length 38.5
  Top Layer w0.3: K8.3 v1(73.09,36.33)
  Bottom Layer w0.3: v1(73.09,36.33) 59.5,49.92 59.5,66.88 CN3.1
CH2_2HZ_A: length 20.9
  Top Layer w0.3: K7.6 70.38,36.5 70.38,38.17 71.28,39.07 v1(71.58,39.07) ; v1(69.18,49.27) C39.2 68.58,51.86 U9.7 U9.6
  Bottom Layer w0.3: v1(71.58,39.07) 69.18,41.47 v1(69.18,49.27)
CH2_8HZ_A: length 26.2
  Top Layer w0.3: 60.45,50.47 60.45,51.86 U9.1 U9.2 ; 60.45,50.47 C43.2 ; 60.45,50.47 59.85,51.07 v1(58.05,51.07) ; K6.6 61.59,35.23 60.09,36.73 60.09,37.93 61,38.83 v1(61.59,38.83)
  Inner1 w0.3: v1(58.05,51.07) 57.75,51.07 57.15,50.47 57.15,43.27 v1(61.59,38.83)
CH2_40HZ_A: length 33.8
  Top Layer w0.3: v1(66.46,56.46) 67.06,57.06 U9.9 U9.8 68.58,57.91 C40.1 ; v1(49.96,39.06) 49.96,36.6 K5.6
  Inner2 w0.3: v1(66.46,56.46) 66.46,55.56 v1(49.96,39.06)
CH2_130HZ_A: length 33.3
  Top Layer w0.3: v1(41.28,36.42) K4.6 ; C46.1 60.71,59.65 U9.14 60.11,57.66 v1(58.91,56.46)
  Inner2 w0.3: v1(41.28,36.42) 41.28,37.02 58.91,54.66 v1(58.91,56.46)
CH2_530HZ_A: length 25
  Top Layer w0.3: 41.15,51.99 42.42,51.99 42.67,51.74 42.67,49.74 v1(42.07,49.14) ; v1(32.47,39.55) 31.27,39.55 29.62,37.89 29.62,36.63 K3.6
  Inner1 w0.3: v1(42.07,49.14) v1(32.47,39.55)
CH2_1030HZ_A: length 25.5
  Top Layer w0.3: v1(25.24,40.44) 25.24,36.84 24.34,35.94 21.65,35.94 K2.6 ; 36.07,51.99 34.8,51.99 34.54,51.74 34.54,49.74 v1(33.94,49.14)
  Inner2 w0.3: v1(33.94,49.14) v1(25.24,40.44)
CH2_2030HZ_A: length 43.5
  Top Layer w0.3: C50.1 42.67,57.78 U10.8 U10.9 v1(40.55,56.93) ; v1(21.65,39.23) 17.75,39.23 14.45,35.93 11.34,35.93 K1.6
  Inner2 w0.3: v1(21.65,39.23) 39.35,56.93 v1(40.55,56.93)
CH2_A: length 90.3
  Top Layer w0.3: v1(72.31,46.93) 72.62,46.93 76.22,43.33 76.22,42.13 81.02,37.33 K8.7 ; v1(58.46,49.33) R43.1 ; v1(71.12,48.13) 71.12,48.79 R37.1 ; v1(44.06,57.13) 44.06,59.71 R48.2 ; R45.1 44.2,49.93 v1(45.25,49.93) ; R42.2 60.04,58.86 v1(60.08,58.86) ; v1(33.73,50.4) 33.73,50.38 R51.1 ; v1(69.98,58.26) R40.2
  Inner1 w0.3: v1(33.73,50.4) 34.46,51.13 44.06,51.13 ; v1(45.25,49.93) 44.06,51.13 ; 44.06,51.13 v1(44.06,57.13)
  Inner2 w0.3: v1(60.08,58.86) 60.08,52.26 58.46,50.64 v1(58.46,49.33)
  Bottom Layer w0.3: v1(60.08,58.86) 60.98,59.76 68.48,59.76 v1(69.98,58.26) 69.98,56.76 71.12,55.63 v1(71.12,48.13) v1(72.31,46.93) ; v1(45.25,49.93) 47.06,49.93 47.35,49.63 58.16,49.63 v1(58.46,49.33)
CH2_FILTER_A: length 123.3
  Top Layer w0.3: 51.74,32.63 K5.5 50.53,32.03 42.18,32.03 K4.5 40.68,32.33 38.31,32.33 38.02,32.03 v1(33.22,32.03) 32.31,32.03 31.41,32.93 K3.5 30.22,32.03 21.13,32.03 20.83,32.33 ; 51.74,32.63 51.74,32.93 52.63,33.83 60.69,33.83 K6.5 62.5,33.83 70.85,33.83 K7.5 72.66,33.83 81.02,33.83 K8.5 ; 51.74,32.63 v1(51.74,32.03) ; 20.83,32.33 K2.5 19.93,33.83 11.44,33.83 K1.5 ; 20.83,32.33 20.83,29.01 K10.2 ; v1(57.84,26.82) R54.2 ; v1(34.21,60.64) R50.2
  Inner1 w0.3: v1(57.84,26.82) 52.63,32.03 v1(51.74,32.03) ; v1(33.22,32.03) 31.72,33.53 31.72,39.83 35.31,43.43 35.31,47.03 33.01,49.33 33.01,59.44 v1(34.21,60.64)
CH2_FILTER_C: length 85.6
  Top Layer w0.3: R49.1 34.81,57.54 U10.14 33.9,57.53 30,53.63 v1(30,52.13) ; v1(20.79,27.32) K10.7 ; v1(59.09,23.52) R58.2
  Inner1 w0.3: v1(20.79,27.32) 20.79,43.52 29.4,52.13 v1(30,52.13)
  Inner2 w0.3: v1(20.79,27.32) 45.09,27.32 48.89,23.52 v1(59.09,23.52)
CH2_INPUT: length 35.6
  Top Layer w0.3: K8.6 75.91,41.13 v1(75.91,41.43)
  Bottom Layer w0.3: CN4.1 75.91,65.08 v1(75.91,41.43)
CS1: length 8.2
  Top Layer w0.3: U5.23 21.71,52.01 20.51,50.81 v1(19.31,50.81) ; v1(17.21,50.21) 17.01,50.41 16.31,50.41 15.99,50.73 U6.9
  Inner1 w0.3: v1(19.31,50.81) 17.81,50.81 v1(17.21,50.21)
CS2: length 30.2
  Top Layer w0.3: v1(19.64,47.13) 19.64,48.63 U6.10 ; U12.23 31.94,27.9 v1(31.94,31.53)
  Bottom Layer w0.3: v1(31.94,31.53) 31.94,34.83 v1(19.64,47.13)
EN: length 50.4
  Top Layer w0.3: U5.21 23.01,50.21 22.71,49.91 20.66,49.91 20.31,50.25 19.71,50.25 ; v1(33.21,30.33) 33.21,27.93 U12.21 ; 19.71,50.25 v1(19.71,49.66) ; 19.71,50.25 19.11,50.25 17.61,51.75 17.61,52.35 14.69,55.28 U6.14
  Inner2 w0.3: v1(19.71,49.66) 18.51,48.45 18.51,35.13 19.11,34.53 22.71,34.53 26.91,30.33 v1(33.21,30.33)
G: length 55.5
  Inner1 w0.3: v1(48.64,15.34) 69.34,15.34 70.24,16.24 77.38,16.24 SW2.4 81.53,15.01 SW1.2
  Inner2 w0.3: v1(48.64,15.34) 44.14,15.34 CN5.20 CN5.19
NRST: length 11.9
  Top Layer w0.3: 3.17,51.84 5.28,53.94 11.24,53.94 12.74,52.44 U6.4
R: length 62
  Inner2 w0.3: 32,3.2 32,5.74
  Bottom Layer w0.3: 78.64,8.3 78.64,6.5 73.24,1.1 34.1,1.1 32,3.2 ; 78.64,8.3 78.64,12.44 SW2.3 ; 78.64,8.3 82.15,8.3 SW1.1
REF: length 40.1
  Bottom Layer w0.3: 71,9.45 57.44,9.45 U14.2 52.41,4.42 51.5,4.42 49.65,2.56 CN6.1 ; 71,9.45 71,12.47 ; 71,9.45 75.19,5.25 75.19,4.35 U14.35
REL1: length 28.3
  Top Layer w0.3: U12.3 32.68,22.21 32.68,21.73 31.78,20.83 v1(26.08,20.83) ; v1(17.68,17.83) 11.98,12.13 LED13.1 10.5,10.94 K11.8
  Inner2 w0.3: v1(26.08,20.83) 23.08,17.83 v1(17.68,17.83)
REL2: length 21
  Top Layer w0.3: U12.4 33.3,21.34 33.99,20.65 40.89,20.65 41.79,19.75 41.79,12.9 LED14.1 39.71,10.82 K12.8
REL3: length 16.7
  Top Layer w0.3: U12.5 33.95,21.62 v1(34.25,21.32) ; K13.8 25.19,12.14 26.27,12.14 ; v1(27.17,12.44) 26.87,12.14 26.27,12.14 ; 26.27,12.14 LED15.1
  Bottom Layer w0.3: v1(34.25,21.32) 27.17,14.24 v1(27.17,12.44)
REL4: length 27.2
  Top Layer w0.3: v1(15.28,22.24) 14.98,22.54 LED17.1 10.5,21.36 K9.8 ; 34.6,22.24 34.6,22.84 34,23.44 v1(33.28,23.44)
  Inner2 w0.3: v1(33.28,23.44) 32.08,22.24 v1(15.28,22.24)
REL5: length 13.9
  Top Layer w0.3: K10.8 25.11,21.36 LED16.1 28.05,24.3 34.09,24.3 35.25,23.14 U12.7
RELAY1: length 69.6
  Top Layer w0.3: v1(22.63,47.91) 22.36,47.64 U5.3 ; K8.8 81.02,41.43 ; 81.02,41.43 81.02,42.54 LED5.1 ; 81.02,41.43 79.22,41.43 v1(78.91,41.13)
  Bottom Layer w0.3: v1(78.91,41.13) 73.52,35.73 72.91,35.73 61.63,47.01 23.53,47.01 v1(22.63,47.91)
RELAY2: length 53.4
  Top Layer w0.3: v1(52.89,47.61) 53.49,47.01 66.39,47.01 LED7.1 71.75,41.64 K7.8 ; U5.4 23.01,47.54 23.68,48.21 v1(24.09,48.21)
  Bottom Layer w0.3: v1(52.89,47.61) 24.69,47.61 v1(24.09,48.21)
RELAY3: length 42.7
  Top Layer w0.3: v1(24.11,45.82) 23.66,46.27 U5.5 ; K6.8 61.59,41.64 LED6.1 56.81,46.42 v1(44.81,46.42)
  Bottom Layer w0.3: v1(44.81,46.42) 43.61,45.22 24.71,45.22 v1(24.11,45.82)
RELAY4: length 31.8
  Top Layer w0.3: v1(26.25,48.22) 24.93,48.22 24.45,47.75 24.45,47.15 U5.6 ; K5.8 51.44,41.64 LED9.1 47.25,45.82 v1(34.65,45.82)
  Inner1 w0.3: v1(34.65,45.82) 28.65,45.82 v1(26.25,48.22)
RELAY5: length 20.6
  Top Layer w0.3: K4.8 41.28,41.64 LED8.1 39.19,43.72 30.49,43.72 v1(29.89,44.32) ; v1(27.49,44.32) 25.99,44.32 24.96,45.35 U5.7
  Inner1 w0.3: v1(29.89,44.32) v1(27.49,44.32)
RELAY6: length 9.5
  Top Layer w0.3: K3.8 31.12,41.64 LED11.1 27.53,45.22 26.33,45.22 25.61,45.94 U5.8
RELAY7: length 12.1
  Top Layer w0.3: 20.23,41.13 20.38,41.13 v1(21.58,42.33) ; 20.23,41.13 19.65,41.71 19.65,42.82 ; 20.23,41.13 K2.8 ; v1(26.38,45.93) 26.38,46.89 U5.9
  Inner1 w0.3: v1(26.38,45.93) 25.18,45.93 v1(21.58,42.33)
RELAY8: length 23.6
  Top Layer w0.3: v1(21.64,45.93) 15.94,45.93 K1.8 10.54,41.64 LED12.1 ; v1(27.04,45.93) 27.04,46.88 U5.10
  Inner2 w0.3: v1(27.04,45.93) 27.04,46.23 26.44,46.83 22.54,46.83 v1(21.64,45.93)
SCK: length 40.5
  Top Layer w0.3: v1(23.36,49.61) 23.66,49.91 U5.20 23.66,54.21 20.5,57.38 U6.11 ; U12.20 33.86,27.93 v1(33.86,31.31)
  Bottom Layer w0.3: v1(23.36,49.61) 21.86,48.11 21.86,47.21 33.86,35.21 v1(33.86,31.31)
SEN_CH1: length 10.9
  Top Layer w0.3: CN5.1 11.68,3.25 3.99,10.94
SEN_CH2: length 43.7
  Top Layer w0.3: v1(50.98,5.74) 52.96,5.74 U14.4
  Bottom Layer w0.3: CN5.2 12.88,4.54 49.78,4.54 v1(50.98,5.74)
SEN_CH3: length 42.9
  Inner1 w0.3: U14.5 54.39,2.6 46.62,2.6 45.12,1.1 16.32,1.1 CN5.3
SEN_CH4: length 7
  Top Layer w0.3: v1(16.92,8.44) 16.92,9.28 K13.6
  Bottom Layer w0.3: CN5.4 v1(16.92,8.44)
SEN_CH5: length 41.6
  Inner1 w0.3: U14.7 55.06,2 v1(50.36,2)
  Inner2 w0.3: v1(50.36,2) 49.46,1.1 18.86,1.1 16.76,3.2
SEN_CH6: length 42.9
  Top Layer w0.3: U14.8 53.1,8.14 v1(53.06,8.14)
  Inner1 w0.3: 16.76,5.74 20.06,9.04 52.16,9.04 v1(53.06,8.14)
SEN_CH7: length 52.1
  Top Layer w0.3: v1(63.4,1.7) 62.2,0.5 22,0.5 CN5.7
  Bottom Layer w0.3: v1(63.4,1.7) 59.54,1.7 U14.9
SEN_CH8: length 13.8
  Top Layer w0.3: K13.3 18.59,14.93 v1(17.8,14.14)
  Inner2 w0.3: CN5.8 19.3,12.64 v1(17.8,14.14)
SEN_CH9: length 15
  Top Layer w0.3: v1(27.84,8.3) 30.68,8.3 K12.6
  Inner2 w0.3: CN5.9 23.04,4.4 24.84,4.4 25.74,5.3 25.74,6.2 v1(27.84,8.3)
SEN_CH10: length 38.6
  Inner1 w0.3: CN5.10 23.16,4.42 50.53,4.42 51.73,5.62 58.16,5.62 U14.12
SEN_CH11: length 38
  Top Layer w0.3: U14.13 58.82,1.95 51.94,1.95 49.54,4.35 25.54,4.35 CN5.11
SEN_CH12: length 37.9
  Inner1 w0.3: v1(57.51,7.54) 26.18,7.54 CN5.12
  Inner2 w0.3: v1(57.51,7.54) U14.14
SEN_CH13: length 18.6
  Top Layer w0.3: K12.3 32.36,17.6 v1(32.32,17.6)
  Inner2 w0.3: v1(32.32,17.6) 33.22,16.7 33.22,11.3 28.12,6.2 28.12,4.4 CN5.13
SEN_CH14: length 36.1
  Inner1 w0.3: CN5.14 28.12,6.94 59.38,6.94 U14.16
SEN_CH15: length 35.2
  Top Layer w0.3: U14.17 60.51,1.1 31.56,1.1 CN5.15
SEN_CH16: length 32.5
  Top Layer w0.3: v1(3.14,18.56) 3.99,18.56
  Bottom Layer w0.3: CN5.16 28.86,5.74 16.04,18.56 v1(3.14,18.56)
SI: length 40
  Top Layer w0.3: U6.13 15.46,57.25 15.46,56.51 16.06,55.91 19.96,55.91 22.36,53.51 U5.22 v1(22.36,50.51) ; U12.22 32.56,27.93 v1(32.56,31.31)
  Bottom Layer w0.3: v1(32.56,31.31) 32.56,35.81 21.16,47.21 21.16,49.31 v1(22.36,50.51)
SO: length 48.8
  Top Layer w0.3: U6.12 15.99,58.62 16.24,58.88 20.27,58.88 24.31,54.83 U5.19 v1(24.31,51.71) ; 34.6,27.84 34.51,27.93 v1(34.51,29.51)
  Bottom Layer w0.3: v1(24.31,51.71) 22.81,51.71 18.91,47.81 18.91,43.61 33.01,29.51 v1(34.51,29.51)
SWCLK: length 8.3
  Top Layer w0.3: v1(5.39,56.78) 5.99,57.38 U6.20
  Bottom Layer w0.3: v1(5.39,56.78) 4.3,56.78 CN2.6
SWDIO: length 9.6
  Top Layer w0.3: U6.19 11.44,56.48 11.14,56.18 3.92,56.18 CN2.4
SYNC: length 71.7
  Top Layer w0.3: v1(16.24,49.83) 15.34,50.73 U6.8 ; v1(61.24,12.33) 64.01,12.33 R74.2
  Bottom Layer w0.3: v1(16.24,49.83) 16.24,45.63 39.94,21.94 51.64,21.94 v1(61.24,12.33)
USB_N: length 8.5
  Top Layer w0.3: USB1.A7 12.83,63.05 ; 12.83,63.05 12.83,57.47 U6.17 ; 12.83,63.05 13.73,63.05 13.83,63.15 USB1.B7
USB_P: length 9.3
  Top Layer w0.3: U6.18 12.09,59.21 12.33,59.45 USB1.B6 12.33,64.66 12.52,64.85 13.14,64.85 13.33,64.66 USB1.A6
$1N532: length 2.1
  Top Layer w0.3: U1.6 76.33,25.48 C8.2
$1N675: length 5.2
  Top Layer w0.3: R2.2 66.29,24.29 R1.1 66.35,25.74 C5.1 68.34,26.13 69.94,26.13
$1N1417: length 5.3
  Top Layer w0.3: U3.2 68.41,20.49 C11.1 66.35,20.02 R7.1 66.29,18.57 R8.2
$1N1423: length 2
  Top Layer w0.3: U3.6 76.38,19.84
$1N2713: length 1.9
  Top Layer w0.28: C9.2 29.84,63.87 U2.9
$1N2718: length 4
  Top Layer w0.28: U2.1 U2.2 U2.3 29.26,58.63 L1.1
$1N3279: length 2.6
  Top Layer w0.3: 40.26,67.67 42.58,67.67 R4.2
$1N3737: length 2.6
  Top Layer w0.3: 35.31,67.67 37.62,67.67 R3.2
$1N3816: length 2.5
  Top Layer w0.3: 45.21,67.67 47.53,67.67 R5.2
$1N3858: length 2.6
  Top Layer w0.3: 50.04,67.67 52.55,67.67 R6.2
$1N4254: length 2
  Top Layer w0.3: U6.1 10.75,51.59 R17.1
$1N4488: length 2.4
  Top Layer w0.3: USB1.A5 14.33,62.54 R20.2
$1N4491: length 2.3
  Top Layer w0.3: R19.2 11.33,62.29 USB1.B5
$1N4637: length 7.5
  Top Layer w0.3: R18.2 4.77,50.37 4.17,49.77 1.28,49.77 0.98,50.07 0.98,50.91 1.91,51.84
$1N5843: length 2.1
  Top Layer w0.3: LED6.2 R11.1
$1N5844: length 2.1
  Top Layer w0.3: LED8.2 R13.1
$1N5845: length 2.1
  Top Layer w0.3: LED11.2 R14.1
$1N5846: length 2.1
  Top Layer w0.3: LED9.2 R12.1
$1N5847: length 2.1
  Top Layer w0.3: LED7.2 R10.1
$1N5848: length 2.1
  Top Layer w0.3: LED5.2 R9.1
$1N6791: length 3.7
  Top Layer w0.3: U7.10 C24.1 80.08,59.9 R23.1
$1N6807: length 2.8
  Top Layer w0.3: R22.1 80.19,48.47 C21.1 82.88,48.47 R21.2
$1N6808: length 3.7
  Top Layer w0.3: R22.2 80.08,49.87 C23.2 U7.5
$1N6809: length 3.7
  Top Layer w0.3: U7.3 C27.2 74.86,49.87 R28.2
$1N6810: length 2.8
  Top Layer w0.3: R27.2 72.06,48.47 C25.1 74.75,48.47 R28.1
$1N7802: length 2.8
  Top Layer w0.3: R24.1 82.88,61.3 C22.2 80.19,61.3 R23.2
$1N7987: length 2.8
  Top Layer w0.3: R26.1 72.06,61.3 C28.2 74.75,61.3 R25.2
$1N7993: length 3.7
  Top Layer w0.3: R25.1 74.86,59.9 C26.2 U7.12
$1N9202: length 2.8
  Top Layer w0.3: R32.1 56.59,61.3 C32.2 53.9,61.3 R31.2
$1N9216: length 3.7
  Top Layer w0.3: R31.1 53.79,59.9 52.75,59.9 ; 52.75,59.9 52.75,57.74 52.83,57.66 ; 52.75,59.9 C34.1
$1N9241: length 2.8
  Top Layer w0.3: R29.2 56.97,48.47 C31.1 54.28,48.47 R30.1
$1N9249: length 3.7
  Top Layer w0.3: 52.83,52.12 C33.2 54.18,49.87 R30.2
$1N9253: length 3.7
  Top Layer w0.3: U8.3 C36.2 48.95,49.87 R36.2
$1N9257: length 2.8
  Top Layer w0.3: R35.2 46.15,48.47 C35.1 48.84,48.47 R36.1
$1N10515: length 2.1
  Top Layer w0.3: LED10.2 R15.1
$1N10516: length 2.1
  Top Layer w0.3: LED12.2 R16.1
$1N10708: length 3.8
  Top Layer w0.3: R34.1 R33.2 49.27,57.9 U8.13
$1N12227: length 3.7
  Top Layer w0.3: 63.25,52.12 C45.2 61.9,49.87 R44.2
$1N12229: length 2.8
  Top Layer w0.3: R43.2 59.11,48.47 C43.1 61.8,48.47 R44.1
$1N12238: length 3.7
  Top Layer w0.3: U9.10 C42.1 67.13,59.9 R39.1
$1N12241: length 3.7
  Top Layer w0.3: U9.5 C41.2 67.13,49.87 R38.2
$1N12243: length 2.8
  Top Layer w0.3: R37.2 69.92,48.47 C39.1 67.24,48.47 R38.1
$1N12255: length 2.8
  Top Layer w0.3: R39.2 67.24,61.3 C40.2 69.92,61.3 R40.1
$1N12267: length 3.7
  Top Layer w0.3: R41.1 61.9,59.9 C44.2 63.25,57.66
$1N12269: length 2.8
  Top Layer w0.3: R41.2 61.8,61.3 C46.2 59.11,61.3 R42.1
$1N12283: length 3.7
  Top Layer w0.3: R52.2 35.99,49.74 37.34,49.74 37.34,51.99
$1N12285: length 2.8
  Top Layer w0.3: R52.1 35.89,48.34 C53.1 33.2,48.34 R51.2
$1N12298: length 3.7
  Top Layer w0.3: R47.1 41.22,59.77 C52.1 U10.10
$1N12301: length 3.7
  Top Layer w0.3: 39.88,51.99 39.88,49.74 41.22,49.74 R46.2
$1N12303: length 2.8
  Top Layer w0.3: R46.1 41.33,48.34 C49.1 44.02,48.34 R45.2
$1N12314: length 2.8
  Top Layer w0.3: R48.1 44.02,61.17 C50.2 41.33,61.17 R47.2
$1N12337: length 3.8
  Top Layer w0.3: U10.13 36.31,57.77 R49.2 R50.1
$1N24901: length 5.5
  Top Layer w0.3: X1.1 10.03,46.92 10.84,47.73 10.84,50.13 11.44,50.73 U6.2
$1N24910: length 3
  Top Layer w0.3: U6.3 12.09,48.69 12.02,48.62
$2N474: length 3.8
  Top Layer w0.3: U11.3 48.8,26.57 R53.1 R55.2
$2N479: length 5.9
  Top Layer w0.3: U11.5 48.22,23.9 47.32,23 45.99,23 R57.1 R59.2
$2N485: length 4.1
  Top Layer w0.3: U11.12 54.84,26.82 R54.1 R56.2
$2N486: length 4.1
  Top Layer w0.3: R60.2 R58.1 54.84,23.52 U11.10
$2N935: length 3.9
  Top Layer w0.3: R68.2 R66.1 47.99,16.03 U13.3
$2N936: length 3.9
  Top Layer w0.3: U13.5 48,13.49 R72.2 R70.1
$2N939: length 3.9
  Top Layer w0.3: U13.12 57.8,16.03 R67.1 R69.2
$2N940: length 3.9
  Top Layer w0.3: U13.10 57.79,13.49 R71.1 R73.2
$2N4173: length 2.1
  Top Layer w0.3: 11.68,13.83 R61.1
$2N4174: length 2.1
  Top Layer w0.3: LED14.2 R62.1
$2N4175: length 2.1
  Top Layer w0.3: 26.29,13.83 R63.1
$2N4176: length 2.1
  Top Layer w0.3: LED17.2 R64.1
$2N4177: length 2.1
  Top Layer w0.3: LED16.2 R65.1

## Copper pours and planes (outline as drawn; the poured copper is in the pictures)
GND on Top Layer: -3.3,71.65 87.5,71.65 87.5,-2.26 -3.3,-2.26
GND on Bottom Layer: -2.54,71.52 87.12,71.52 87.12,-1.5 -2.54,-1.5

Small or netless copper shapes (teardrops, artwork), in the pictures only: 1 on Bottom Layer

## Text on the board
Top Silkscreen Layer: GND | REF | CH1 | CH2 | -12 | +12
